# EAGLE design furby_board_v1 (EAGLE 6.3)
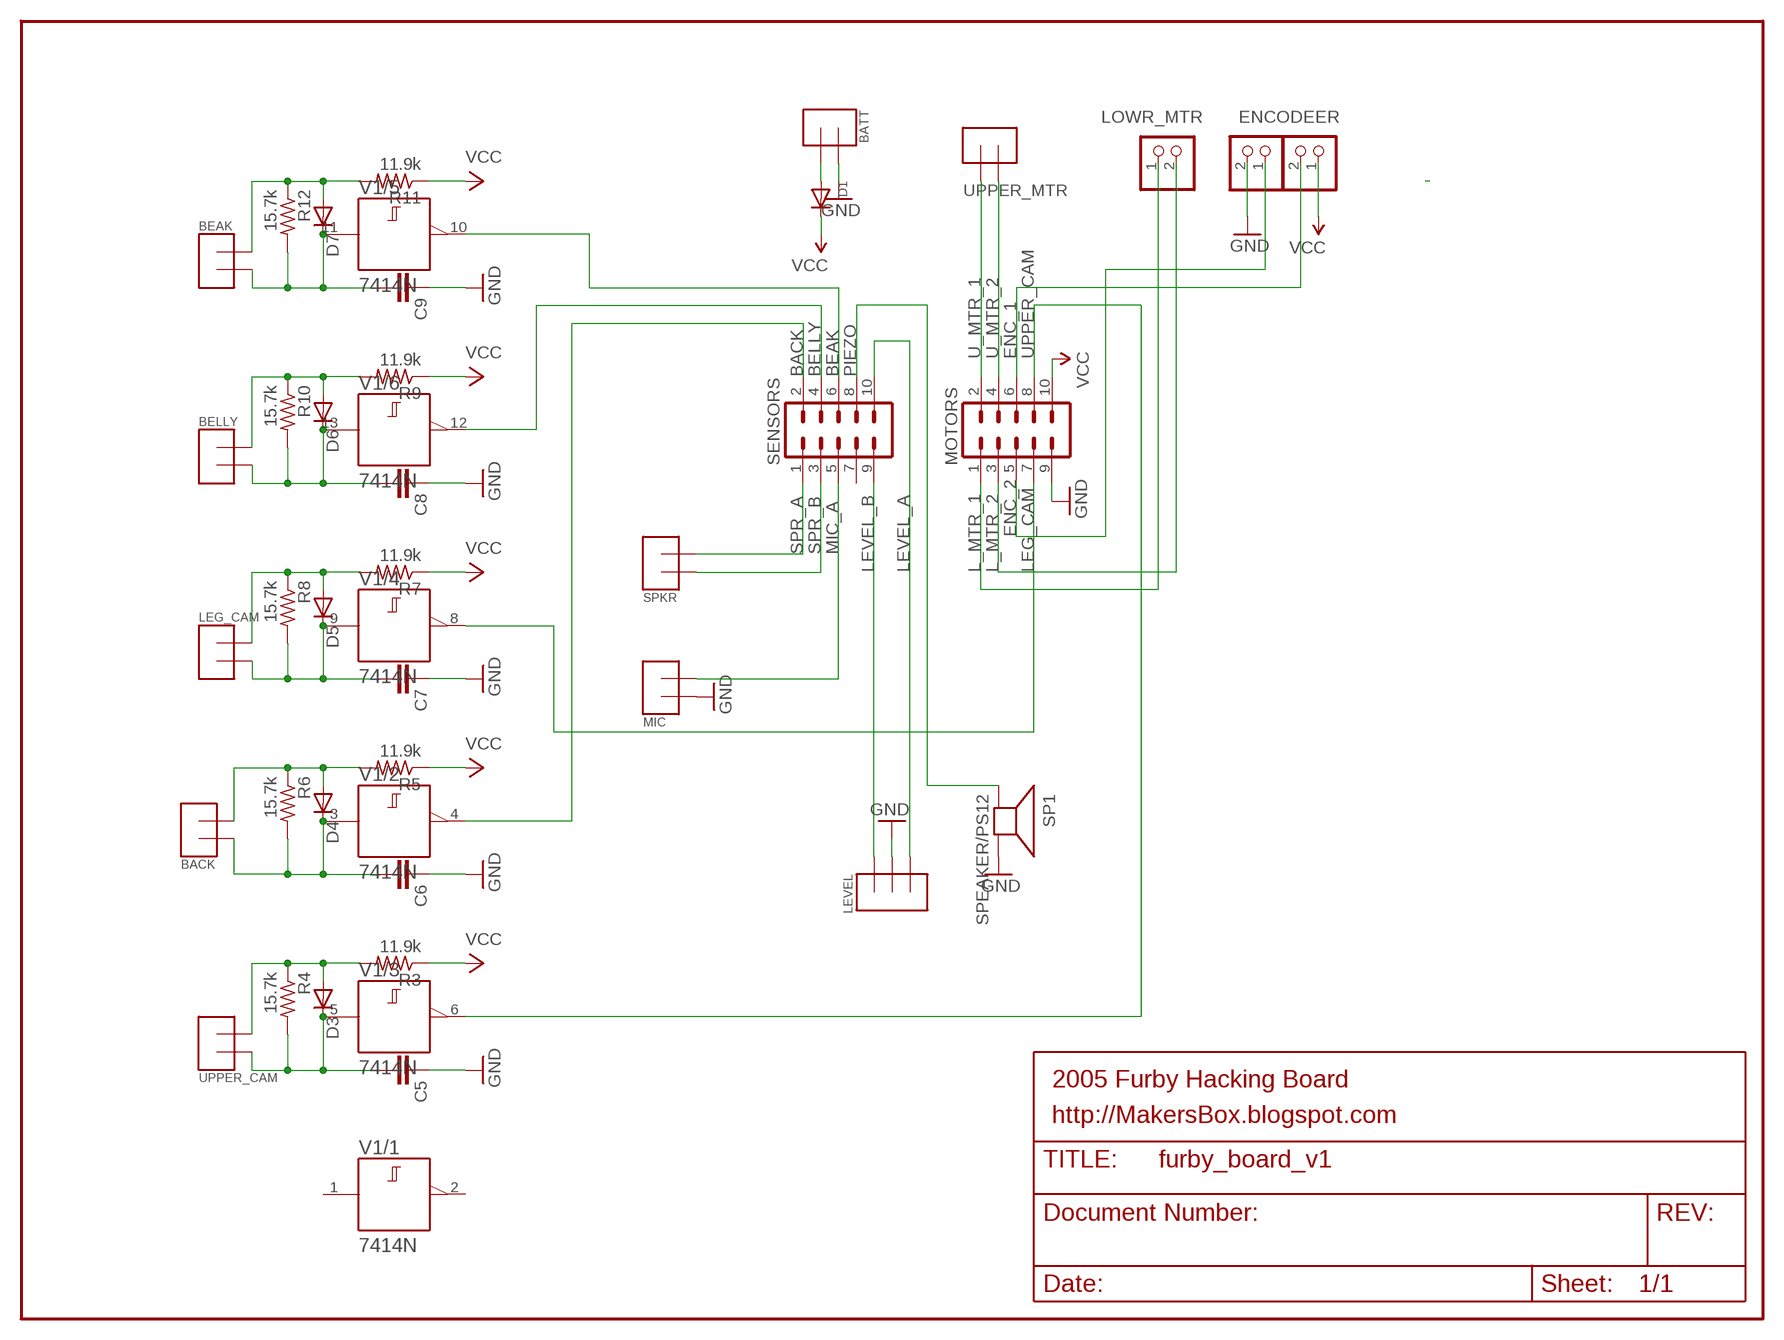
[diagram p0: schematic, sheet 1]

## Parts
BACK  TERMINAL2  [TERMINAL_2]
BATT  TERMINAL2  [TERMINAL_2]
BEAK  TERMINAL2  [TERMINAL_2]
BELLY  TERMINAL2  [TERMINAL_2]
C5  CAPPTH  [CAP-PTH-SMALL]
C6  CAPPTH  [CAP-PTH-SMALL]
C7  CAPPTH  [CAP-PTH-SMALL]
C8  CAPPTH  [CAP-PTH-SMALL]
C9  CAPPTH  [CAP-PTH-SMALL]
D1  DIODEDO-1N4148  [DO-1N4148]
D3  DIODE-D-2.5  [D-2.5]
D4  DIODE-D-2.5  [D-2.5]
D5  DIODE-D-2.5  [D-2.5]
D6  DIODE-D-2.5  [D-2.5]
D7  DIODE-D-2.5  [D-2.5]
ENCODE2  JST_2PIN-THM  [JST-PH-2-THM]
ENCODEER  JST_2PIN-THM  [JST-PH-2-THM]
LEG_CAM  TERMINAL2  [TERMINAL_2]
LEVEL  TERMINAL  [TERMINAL_3]
LOWR_MTR  JST_2PIN-THM  [JST-PH-2-THM]
MIC  TERMINAL2  [TERMINAL_2]
MOTORS  M05X2SHD  [2X5-SHROUDED]
R3  11.9k  R-US_0204/2V  [0204V]
R4  15.7k  R-US_0204/2V  [0204V]
R5  11.9k  R-US_0204/2V  [0204V]
R6  15.7k  R-US_0204/2V  [0204V]
R7  11.9k  R-US_0204/2V  [0204V]
R8  15.7k  R-US_0204/2V  [0204V]
R9  11.9k  R-US_0204/2V  [0204V]
R10  15.7k  R-US_0204/2V  [0204V]
R11  11.9k  R-US_0204/2V  [0204V]
R12  15.7k  R-US_0204/2V  [0204V]
SENSORS  M05X2SHD  [2X5-SHROUDED]
SP1  SPEAKER/PS12  [PS12]
SPKR  TERMINAL2  [TERMINAL_2]
UPPER_CAM  TERMINAL2  [TERMINAL_2]
UPPER_MTR  TERMINAL2  [TERMINAL_2]
V1  7414N  [DIL14]

## Nets
BACK: SENSORS.2 V1.4(/2:Y)
BEAK: SENSORS.6 V1.10(/5:Y)
BELLY: SENSORS.4 V1.12(/6:Y)
ENC_1: ENCODE2.2 MOTORS.6
ENC_2: ENCODEER.1 MOTORS.5
GND [power]: BATT.P$1 C5.1 C6.1 C7.1 C8.1 C9.1 ENCODEER.2 LEVEL.P$2 MIC.P$1 MOTORS.9 SP1.P$2(-)
L_MTR_1: LOWR_MTR.1 MOTORS.1
L_MTR_2: LOWR_MTR.2 MOTORS.3
LEG_CAM: MOTORS.7 V1.8(/4:Y)
LEVEL_A: LEVEL.P$3 SENSORS.10
LEVEL_B: LEVEL.P$1 SENSORS.9
MIC_A: MIC.P$2 SENSORS.5
N$1: BATT.P$2 D1.A
N$12: D3.A R3.2 R4.1 UPPER_CAM.P$2
N$13: C5.2 D3.C R4.2 UPPER_CAM.P$1 V1.5(/3:A)
N$14: BACK.P$2 D4.A R5.2 R6.1
N$15: BACK.P$1 C6.2 D4.C R6.2 V1.3(/2:A)
N$16: D5.A LEG_CAM.P$1 R7.2 R8.1
N$17: C7.2 D5.C LEG_CAM.P$2 R8.2 V1.9(/4:A)
N$18: BELLY.P$1 D6.A R9.2 R10.1
N$19: BELLY.P$2 C8.2 D6.C R10.2 V1.13(/6:A)
N$20: BEAK.P$1 D7.A R11.2 R12.1
N$21: BEAK.P$2 C9.2 D7.C R12.2 V1.11(/5:A)
PIEZO: SENSORS.8 SP1.P$1(+)
SPR_A: SENSORS.1 SPKR.P$2
SPR_B: SENSORS.3 SPKR.P$1
U_MTR_1: MOTORS.2 UPPER_MTR.P$1
U_MTR_2: MOTORS.4 UPPER_MTR.P$2
UPPER_CAM: MOTORS.8 V1.6(/3:Y)
VCC: D1.C ENCODE2.1 MOTORS.10 R3.1 R5.1 R7.1 R9.1 R11.1
Unconnected: SENSORS.7 V1.1(/1:A) V1.2(/1:Y)

## Notes on the sheet
- 2005 Furby Hacking Board
- http://MakersBox.blogspot.com

## Power pins joined to a net without a drawn wire
+UB: V1.14(/+UB:+UB)
-UB: V1.7(/-UB:-UB)

## Library data of the parts
BACK BATT BEAK BELLY LEG_CAM MIC SPKR UPPER_CAM UPPER_MTR = _my-parts:TERMINAL2
C5-C9 = SparkFun:CAP: Capacitor Standard 0603 ceramic capacitor, and 0.1" leaded capacitor.
D1 = adafruit:DIODE: Diode SMADIODE - SMA Surface Mount Package 20V 1A Schottky Diode Digikey: 641-1014-6-ND DO-1N4148 - Through Hole Small Current Diode SOD-123 20V 1 A (.5mV Vf) Schottky Diode - Digikey: MBRX120TPMSCT-ND SOD-323 10V 570mA (.38mV Vf, 3ns) Schottky Diode - Digikey: ZLLS410CT-ND SOD-523 30V 30mA Schottky Diode (RB751S-40TE61) - Digikey: RB751S-40TE61CT-ND SOT23-R/W - SOT23 Package (R = Solder Paste/Reflow Ovens, W = Hand-Soldering) BAT54Film 40V 300mA - Digikey: 497-7162-1-ND
D3-D7 = diode:DIODE-: DIODE
ENCODE2 ENCODEER LOWR_MTR = adafruit_mod:JST_2PIN: JST 2-Pin Connectors of various flavors SMT-RA (S2B-PH-SM4) 4UConnector #17311 SMT (B2B-PH-SM4) THM-RA (S2B-PH) THM (B2B-PH)
LEVEL = _my-parts:TERMINAL
MOTORS SENSORS = SparkFun_mod:M05X2: Header 5x2 Standard 10-pin dual row 0.1" header. Commonly used with AVR-ISP. Use with Spark Fun Electronics SKU: PRT-00778
R3-R12 = adafruit:R-US_: RESISTOR, American symbol
SP1 = adafruit:SPEAKER: SPEAKER Source: Buerklin Added PS12 (for part # PS1240 piezo) http://www.ladyada.net/library/pcb/eaglelibrary.html
V1 = 74ttl-din:74*14: Hex schmitt trigger INVERTER

## Net classes
0 default: width 0.203 mm
1 power: width 0.61 mm

## Board
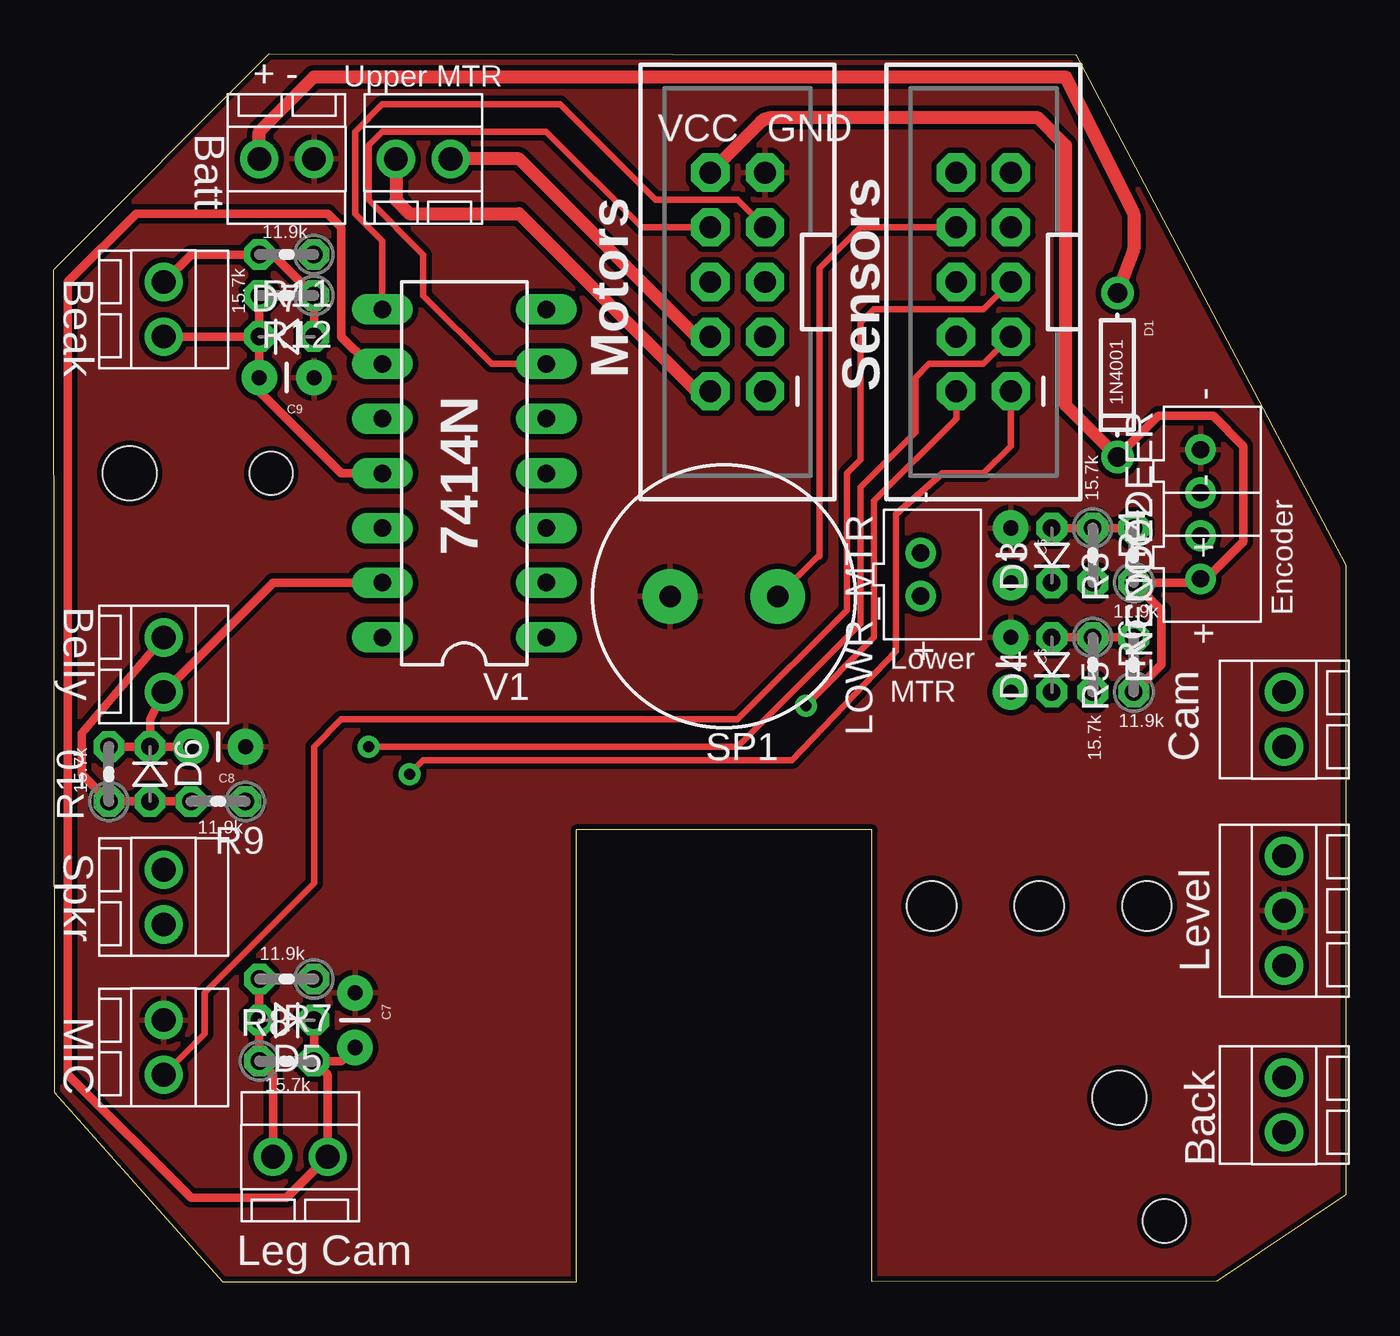
[diagram p1: board, top side]
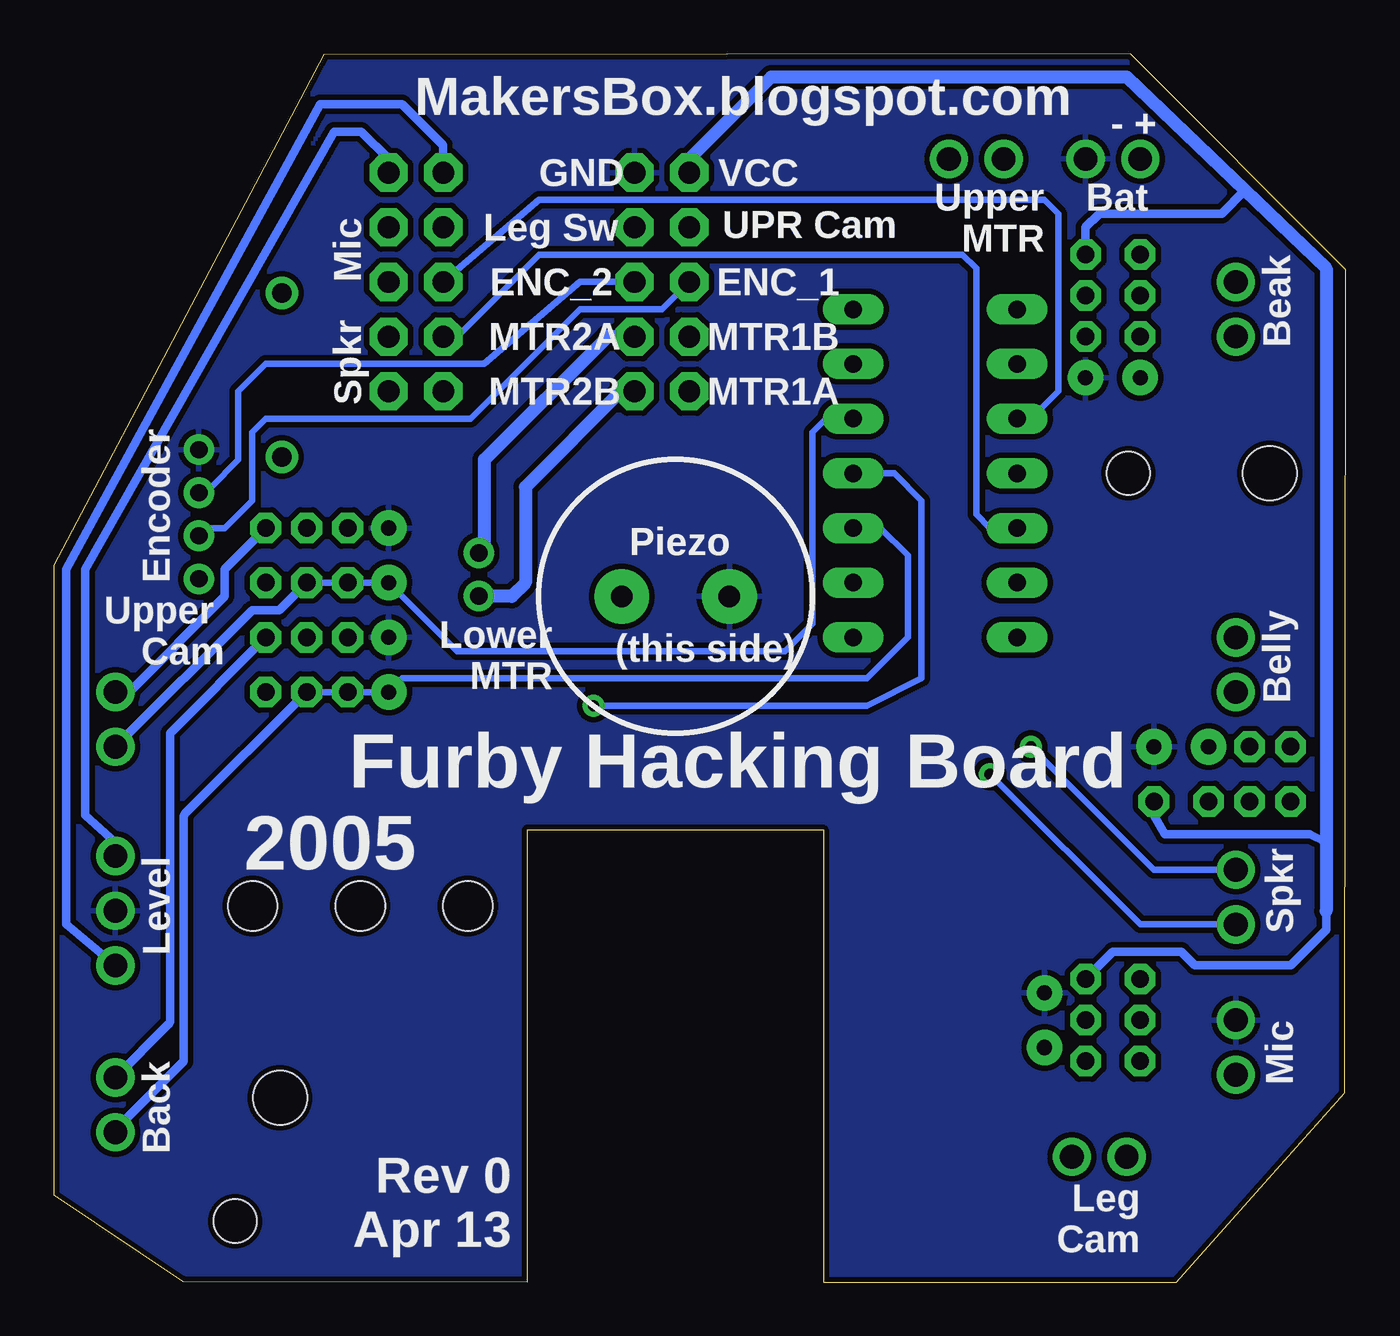
[diagram p2: board, bottom side, seen from below]

Size 60.03 x 57.06 mm. Coordinates in mm from the lower left corner, seen from the top.
Outline: 10.01,57.06 0,47.03 0.05,8.79 7.86,0 24.26,0 24.27,21.01 38.02,21.01 38.02,0.01 54.03,0.05 60.03,4.05 60.03,33.31 47.49,57.01 10,57.05
Copper layers (1*16): Top 0.035mm / dielectric 1.5mm / Bottom 0.035mm
Design rules "SparkFun": minimum track width 8mil, minimum drill 20mil, track to track 8mil, track to pad 8mil, pad to pad 8mil, via to via 8mil, smd to smd 8mil, copper to edge 10mil, drill to drill 8mil, minimum pad ring 12mil, minimum via ring 10mil, stop-mask expansion 4mil, vias tented up to drill 25mil, thermal gap 10mil
Holes 2 mm at 10.11,37.57 51.61,2.84
Holes 2.5 mm at 3.52,37.57 49.52,8.57
Holes 2.29 mm at 45.8,17.47 50.8,17.47 40.8,17.47

### Footprints (pad centres in the part's own frame; a part is rotated, then mirrored left to right if it is on the bottom)
TERMINAL_2 = drill 1.1 pad 1.778: P$1 1.27,0; P$2 -1.27,0
CAP-PTH-SMALL = drill 0.7 pad 1.651: 1 0,0; 2 2.54,0
DO-1N4148 = drill 0.9: A -3.81,0; C 3.81,0
D-2.5 = drill 0.813 octagon: A 1.27,0; C -1.27,0
JST-PH-2-THM = drill 0.8 pad 1.422: 1 1,0; 2 -1,0
TERMINAL_3 = drill 1.1 pad 1.778: P$1 -2.54,0; P$2 0,0; P$3 2.54,0
2X5-SHROUDED = drill 1.016 pad 1.778 octagon: 1 -1.27,5.08; 2 1.27,5.08; 3 -1.27,2.54; 4 1.27,2.54; 5 -1.27,0; 6 1.27,0; 7 -1.27,-2.54; 8 1.27,-2.54; 9 -1.27,-5.08; 10 1.27,-5.08
0204V = drill 0.813 octagon: 1 -1.27,0; 2 1.27,0
PS12 = drill 1 pad 2.54: P$1 -2.5,0; P$2 2.5,0
DIL14 = drill 0.813 long: 1 -7.62,-3.81; 2 -5.08,-3.81; 3 -2.54,-3.81; 4 0,-3.81; 5 2.54,-3.81; 6 5.08,-3.81; 7 7.62,-3.81; 8 7.62,3.81; 9 5.08,3.81; 10 2.54,3.81; 11 0,3.81; 12 -2.54,3.81; 13 -5.08,3.81; 14 -7.62,3.81

### Placement (x,y rotation side)
BACK  57.17,8.23 270 top
BATT  10.82,52.17 0 top
BEAK  5.1,45.19 90 top
BELLY  5.1,28.68 90 top
C5  44.47,35.03 270 top
C6  44.47,29.95 270 top
C7  13.99,13.44 270 top
C8  8.91,24.87 180 top
C9  12.09,42.02 180 top
D1  49.43,42.14 270 top
D3  46.38,33.76 90 top
D4  46.38,28.68 90 top
D5  10.82,12.17 180 top
D6  4.47,23.6 270 top
D7  10.82,43.92 0 top
ENCODE2  53.29,33.67 270 top
ENCODEER  53.29,37.67 270 top
LEG_CAM  11.45,5.82 180 top
LEVEL  57.17,17.25 270 top
LOWR_MTR  40.28,32.87 270 top
MIC  5.1,10.9 90 top
MOTORS  31.77,46.46 180 top
R3  50.19,33.76 90 top
R4  48.28,33.76 270 top
R5  50.19,28.68 90 top
R6  48.28,28.68 270 top
R7  10.82,14.07 180 top
R8  10.82,10.27 0 top
R9  7.64,22.33 180 top
R10  2.56,23.6 90 top
R11  10.82,47.73 180 top
R12  10.82,45.82 180 top
SENSORS  43.2,46.46 180 top
SP1  31.14,31.85 180 top
SPKR  5.1,17.88 90 top
UPPER_CAM  57.17,26.14 270 top
UPPER_MTR  17.17,52.17 180 top
V1  19.07,37.57 90 top

### Tracks (layer width: path | path; a pad name or v marks a point on that pad's centre or on a via)
BACK  (via drill 0.51)
  Top 0.305: SENSORS.2 41.93,40.11 38.12,36.3 38.12,29.95 v34.95,26.77
  Bottom 0.305: V1.4 20.98,37.57 19.71,36.3 19.71,28.05 22.25,26.77 v34.95,26.77
BEAK
  Bottom 0.305: V1.10 14.63,40.11 13.36,41.38 13.36,49.63 13.99,50.27 37.49,50.27 SENSORS.6
BELLY
  Bottom 0.305: SENSORS.4 41.3,43.92 37.49,47.73 17.8,47.73 17.17,47.09 17.17,35.66 16.53,35.03 V1.12
ENC_1
  Bottom 0.305: MOTORS.6 31.77,45.19 35.58,45.19 40.66,40.11 50.19,40.11 50.82,39.48 50.82,36.3 52.09,35.03 52.93,35.03 ENCODE2.2
ENC_2
  Bottom 0.305: MOTORS.5 35.58,46.46 40.03,42.65 50.19,42.65 51.46,41.38 51.46,38.2 52.73,36.93 53.03,36.93 ENCODEER.1
GND
  pour Bottom (isolate 0.254): -5.06,-1.8 -5.06,60.43 62.25,60.43 62.25,-3.07 -5.06,-3.07
  pour Top (isolate 0.254): -3.79,-1.8 -3.79,59.16 60.98,59.16 60.98,-1.8
L_MTR_1
  Bottom 0.61: MOTORS.1 33.68,41.38 38.12,36.93 38.12,32.49 38.76,31.85 40.27,31.85 LOWR_MTR.1
L_MTR_2
  Bottom 0.61: MOTORS.3 34.31,43.92 40.03,38.2 40.03,34.12 LOWR_MTR.2
LEG_CAM
  Top 0.305: V1.8 15.26,48.36 13.99,49.63 13.99,53.45 15.26,54.71 23.52,54.71 27.96,50.27 31.77,50.27 MOTORS.7
LEVEL_A
  Bottom 0.406: LEVEL.P$3 59.46,16.62 59.46,33.12 47.65,54.71 43.84,54.71 41.93,52.81 SENSORS.10
LEVEL_B
  Bottom 0.406: LEVEL.P$1 57.17,20.42 58.57,21.7 58.57,33.12 47.01,53.45 45.74,53.45 44.47,52.17 SENSORS.9
MIC_A
  Top 0.305: SENSORS.5 43.2,45.19 38.12,45.19 37.49,44.55 37.49,38.2 36.85,37.57 36.85,31.22 31.77,26.14 13.36,26.14 12.09,24.87 12.09,18.52 7.01,13.44 7.01,11.54 MIC.P$2
N$1
  Top 0.61: BATT.P$2 9.55,53.45 12.09,55.98 47.01,55.98 50.19,49.63 50.19,47.98 D1.A
N$12
  Top 0.406: D3.A R4.1 R3.2
  Bottom 0.406: R3.2 52.09,33.12 52.09,31.85 56.54,27.41 UPPER_CAM.P$2
N$13
  Bottom 0.305: R4.2 D3.C C5.2 41.3,29.31 26.06,29.31 24.79,30.59 24.79,39.48 24.15,40.11 V1.5
  Bottom 0.406: R4.2 49.55,31.22 50.72,31.22 arc-45 50.9,31.15 UPPER_CAM.P$1
N$14
  Top 0.406: D4.A R6.1 R5.2
  Bottom 0.406: R5.2 54.63,25.51 54.63,12.15 arc45 54.71,11.97 BACK.P$2
N$15
  Bottom 0.305: V1.3 21.61,35.03 20.34,33.76 20.34,29.95 22.25,28.05 43.84,28.05 C6.2 D4.C R6.2
  Bottom 0.406: BACK.P$1 57.17,7.62 arc45 57.1,7.16 54,10.27 54,21.59 arc45 53.92,21.77 R6.2
N$16
  Top 0.406: LEG_CAM.P$1 10.18,9.63 R8.1 D5.A R7.2
N$17
  Top 0.406: R8.2 12.72,9.63 LEG_CAM.P$2 10.82,3.92 6.37,3.92 0.66,9.63 0.66,46.46 3.83,49.63 12.72,49.63 13.36,49 13.36,43.92 14.63,42.65 V1.9 | R8.2 13.36,10.27 C7.2 | R8.2 D5.C
N$18
  Top 0.406: BELLY.P$1 1.29,25.51 1.29,23.6 R10.1 D6.A R9.2
N$19
  Top 0.406: V1.13 10.18,32.49 BELLY.P$2 4.47,26.14 D6.C | R10.2 D6.C | D6.C C8.2
N$20
  Top 0.406: BEAK.P$1 6.37,47.73 R11.2 10.18,47.73 R12.1 D7.A
N$21
  Top 0.406: BEAK.P$2 D7.C | D7.C R12.2 | D7.C C9.2 9.55,41.38 13.36,37.57 V1.11
PIEZO
  Top 0.305: SENSORS.8 37.49,49 35.58,47.09 35.58,33.72 35.5,33.72 SP1.P$1
SPR_A  (via drill 0.51)
  Top 0.305: SENSORS.1 44.47,38.84 43.2,37.57 41.3,37.57 39.14,35.66 39.14,29.31 34.31,24.23 17.17,24.23 v16.53,23.6
  Bottom 0.305: SPKR.P$2 9.55,16.62 v16.53,23.6
SPR_B  (via drill 0.51)
  Top 0.305: SENSORS.3 43.2,42.65 40.66,42.65 40.03,42.02 40.03,39.48 37.49,36.93 37.49,30.59 31.77,24.87 v14.63,24.87
  Bottom 0.305: SPKR.P$1 8.91,19.16 v14.63,24.87
U_MTR_1
  Top 0.61: UPPER_MTR.P$1 15.9,50.27 16.53,49.63 21.61,49.63 29.87,41.38 MOTORS.2
U_MTR_2
  Top 0.61: MOTORS.4 29.87,43.92 21.61,52.17 UPPER_MTR.P$2
UPPER_CAM
  Top 0.305: MOTORS.8 27.33,49 22.88,53.45 15.26,53.45 14.63,52.81 14.63,50.27 17.17,47.73 17.17,45.82 20.34,42.65 V1.6
VCC
  Top 0.406: R5.1 51.46,28.68 51.46,31.22 R3.1 53.11,32.49 ENCODE2.1 53.36,32.6 53.36,32.49 55.27,34.39 55.27,38.84 53.87,40.24 51.33,40.24 D1.C
  Top 0.61: MOTORS.10 32.86,53.89 arc-45 33.31,54.08 45.74,54.08 47.01,52.81 47.01,40.74 D1.C
  Bottom 0.406: R9.1 8.91,21.7 8.4,20.81 1.67,20.81 0.91,20.42 | R11.1 12.09,49 11.45,49.63 5.76,49.63 4.68,50.71 | 0.91,17.25 0.91,16.36 2.56,14.71 7.01,14.71 7.64,15.35 10.82,15.35 R7.1
  Bottom 0.61: MOTORS.10 30.5,52.17 26.69,55.98 10.18,55.98 4.68,50.71 0.91,47.09 0.91,20.42 0.91,17.25

### Text on the board
tPlace: Upper MTR | + - | Batt | VCC | GND | 11.9k | Beak | 15.7k | Motors | Sensors | 1N4001 | 15.7k | 7414N | Belly | 11.9k | Encoder | Lower / MTR | 11.9k | 15.7k | Cam | 15.7k | 11.9k | Spkr | 11.9k | Level | MIC | 15.7k | Back | Leg Cam
bPlace: MakersBox.blogspot.com | - + | VCC | Bat | Upper / MTR | GND | Leg Sw | Beak | UPR Cam | ENC_1 | ENC_2 | Mic | MTR1B | MTR2A | MTR1A | MTR2B | Spkr | Piezo | Piezo | Upper / Cam | Encoder | Belly | Lower / MTR | (this side) | Furby Hacking Board | 2005 | Spkr | Level | Mic | Back | Rev 0 / Apr 13 | Leg / Cam